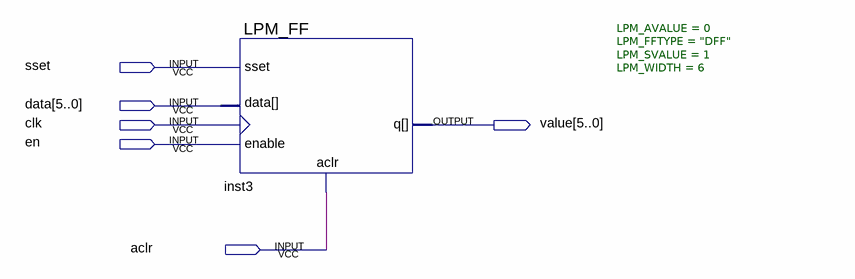
[diagram p0: schematic sheet]
// Quartus schematic test.bdf as structural Verilog: 1 symbols, 6 pins
module test (
  input  sset,
  input  [5:0] data,
  input  clk,
  input  en,
  input  aclr,
  output [5:0] value
);

  LPM_FF #(.LPM_AVALUE(0), .LPM_FFTYPE("DFF"), .LPM_SVALUE(1), .LPM_WIDTH(6)) inst3 (
    .aclr(aclr), .clock(clk), .data(data), .enable(en), .sset(sset), .q(value));
endmodule
